# Altium schematic sheet Sensor_Interface.SchDoc: Sensor Interface
size A4; DrawnBy: Flávio Silva; Engineer: Flávio Silva; Organization: CeNTI; Address1: Rua Fernando Mesquita 2785; Address2: Vila Nova de Famalicão; Address3: 4760-034, Portugal; Revision: 0; SheetNumber: 1; SheetTotal: 4; Project: AM2R- Safe2Wheels
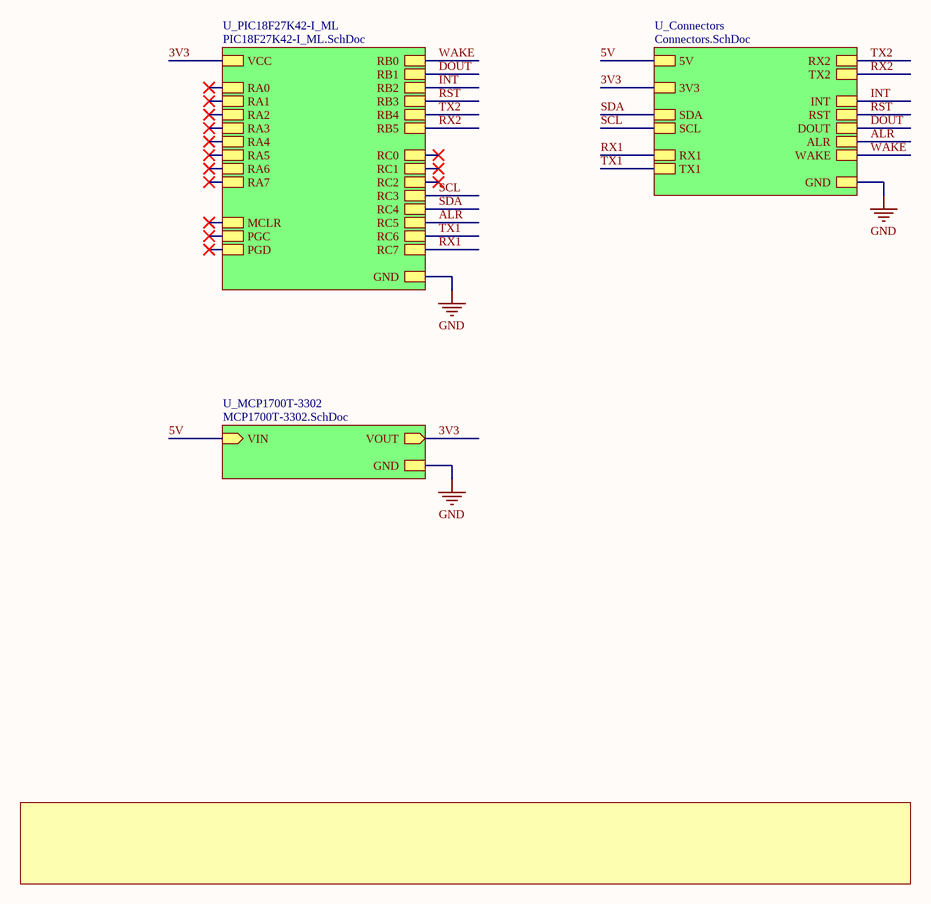
[diagram p0: Sensor_Interface.SchDoc]

## Sub-sheets
U_Connectors = Connectors.SchDoc: 5V, SCL, SDA, INT, GND, RST, DOUT, RX2, TX2, RX1, TX1, ALR, WAKE, 3V3
U_MCP1700T-3302 = MCP1700T-3302.SchDoc: VIN (in), VOUT (out), GND
U_PIC18F27K42-I_ML = PIC18F27K42-I_ML.SchDoc: VCC, GND, RA0, RA1, RA2, RA3, RA4, RA5, RA6, RA7, RC0, RC1, RC2, RC3, RC4, RC5, RC6, RC7, RB0, RB1, RB2, RB3, RB4, RB5, MCLR, PGC, PGD

## Nets
GND: sheet U_PIC18F27K42-I_ML/GND, sheet U_MCP1700T-3302/GND, sheet U_Connectors/GND
3V3: sheet U_PIC18F27K42-I_ML/VCC, sheet U_MCP1700T-3302/VOUT, sheet U_Connectors/3V3
5V: sheet U_MCP1700T-3302/VIN, sheet U_Connectors/5V
ALR: sheet U_PIC18F27K42-I_ML/RC5, sheet U_Connectors/ALR
DOUT: sheet U_PIC18F27K42-I_ML/RB1, sheet U_Connectors/DOUT
INT: sheet U_PIC18F27K42-I_ML/RB2, sheet U_Connectors/INT
RST: sheet U_PIC18F27K42-I_ML/RB3, sheet U_Connectors/RST
RX1: sheet U_PIC18F27K42-I_ML/RC7, sheet U_Connectors/RX1
RX2: sheet U_PIC18F27K42-I_ML/RB5, sheet U_Connectors/TX2
SCL: sheet U_PIC18F27K42-I_ML/RC3, sheet U_Connectors/SCL
SDA: sheet U_PIC18F27K42-I_ML/RC4, sheet U_Connectors/SDA
TX1: sheet U_PIC18F27K42-I_ML/RC6, sheet U_Connectors/TX1
TX2: sheet U_PIC18F27K42-I_ML/RB4, sheet U_Connectors/RX2
WAKE: sheet U_PIC18F27K42-I_ML/RB0, sheet U_Connectors/WAKE

## Notes on the sheet
- Title:
- Project:
- Date:
- Rev:
- Sheet
- of
- Author: